# EAGLE design driver_board_v3_shift_regs (EAGLE 6.5.0)
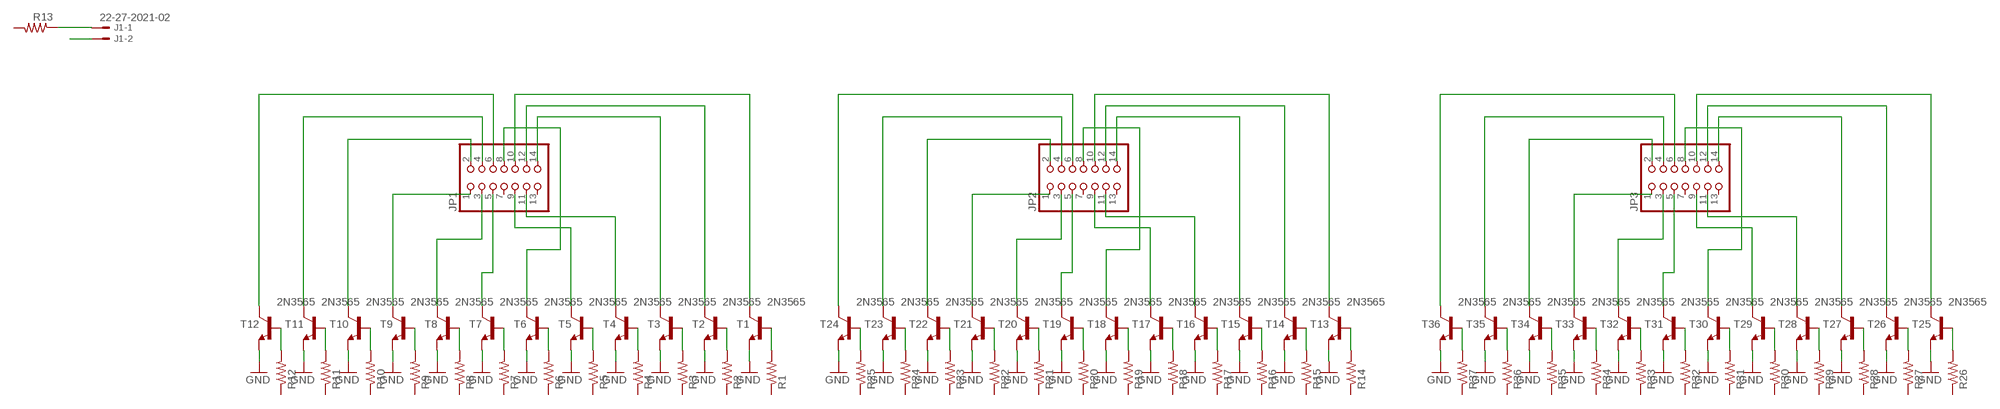
[diagram p0: schematic, sheet 1, part 1 of 2]
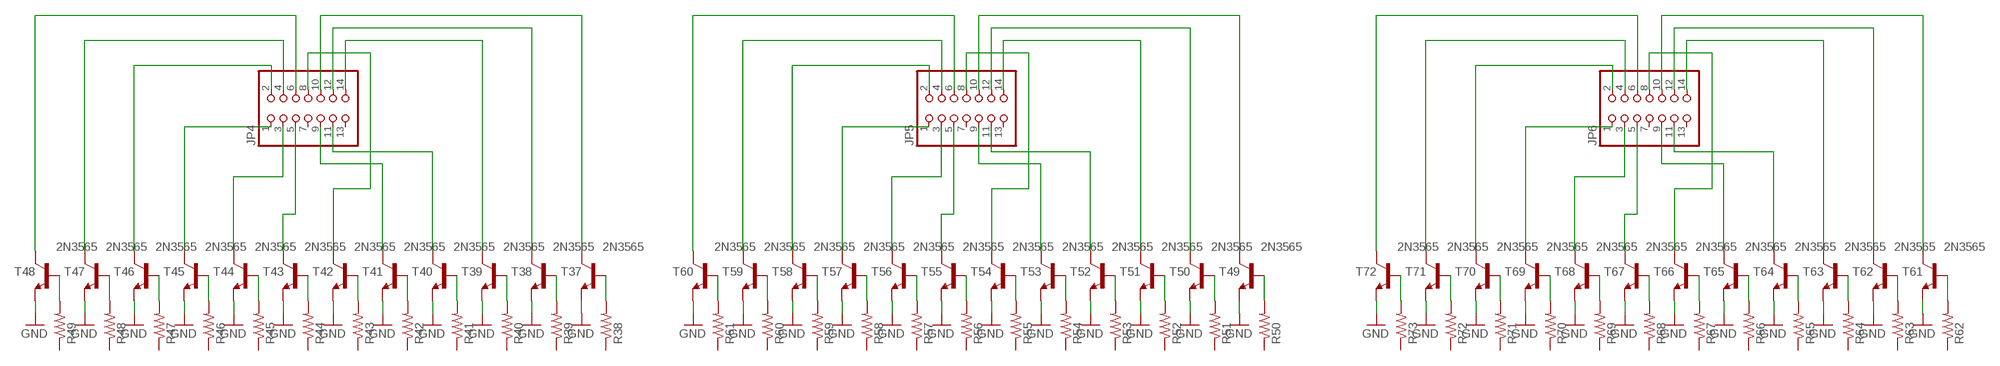
[diagram p1: schematic, sheet 1, part 2 of 2]

## Parts
J1  22-27-2021-02  [6410-02]
JP1  PINHD-2X7  [2X07]
JP2  PINHD-2X7  [2X07]
JP3  PINHD-2X7  [2X07]
JP4  PINHD-2X7  [2X07]
JP5  PINHD-2X7  [2X07]
JP6  PINHD-2X7  [2X07]
R1  R-US_0204/7  [0204/7]
R2  R-US_0204/7  [0204/7]
R3  R-US_0204/7  [0204/7]
R4  R-US_0204/7  [0204/7]
R5  R-US_0204/7  [0204/7]
R6  R-US_0204/7  [0204/7]
R7  R-US_0204/7  [0204/7]
R8  R-US_0204/7  [0204/7]
R9  R-US_0204/7  [0204/7]
R10  R-US_0204/7  [0204/7]
R11  R-US_0204/7  [0204/7]
R12  R-US_0204/7  [0204/7]
R13  R-US_0204/7  [0204/7]
R14  R-US_0204/7  [0204/7]
R15  R-US_0204/7  [0204/7]
R16  R-US_0204/7  [0204/7]
R17  R-US_0204/7  [0204/7]
R18  R-US_0204/7  [0204/7]
R19  R-US_0204/7  [0204/7]
R20  R-US_0204/7  [0204/7]
R21  R-US_0204/7  [0204/7]
R22  R-US_0204/7  [0204/7]
R23  R-US_0204/7  [0204/7]
R24  R-US_0204/7  [0204/7]
R25  R-US_0204/7  [0204/7]
R26  R-US_0204/7  [0204/7]
R27  R-US_0204/7  [0204/7]
R28  R-US_0204/7  [0204/7]
R29  R-US_0204/7  [0204/7]
R30  R-US_0204/7  [0204/7]
R31  R-US_0204/7  [0204/7]
R32  R-US_0204/7  [0204/7]
R33  R-US_0204/7  [0204/7]
R34  R-US_0204/7  [0204/7]
R35  R-US_0204/7  [0204/7]
R36  R-US_0204/7  [0204/7]
R37  R-US_0204/7  [0204/7]
R38  R-US_0204/7  [0204/7]
R39  R-US_0204/7  [0204/7]
R40  R-US_0204/7  [0204/7]
R41  R-US_0204/7  [0204/7]
R42  R-US_0204/7  [0204/7]
R43  R-US_0204/7  [0204/7]
R44  R-US_0204/7  [0204/7]
R45  R-US_0204/7  [0204/7]
R46  R-US_0204/7  [0204/7]
R47  R-US_0204/7  [0204/7]
R48  R-US_0204/7  [0204/7]
R49  R-US_0204/7  [0204/7]
R50  R-US_0204/7  [0204/7]
R51  R-US_0204/7  [0204/7]
R52  R-US_0204/7  [0204/7]
R53  R-US_0204/7  [0204/7]
R54  R-US_0204/7  [0204/7]
R55  R-US_0204/7  [0204/7]
R56  R-US_0204/7  [0204/7]
R57  R-US_0204/7  [0204/7]
R58  R-US_0204/7  [0204/7]
R59  R-US_0204/7  [0204/7]
R60  R-US_0204/7  [0204/7]
R61  R-US_0204/7  [0204/7]
R62  R-US_0204/7  [0204/7]
R63  R-US_0204/7  [0204/7]
R64  R-US_0204/7  [0204/7]
R65  R-US_0204/7  [0204/7]
R66  R-US_0204/7  [0204/7]
R67  R-US_0204/7  [0204/7]
R68  R-US_0204/7  [0204/7]
R69  R-US_0204/7  [0204/7]
R70  R-US_0204/7  [0204/7]
R71  R-US_0204/7  [0204/7]
R72  R-US_0204/7  [0204/7]
R73  R-US_0204/7  [0204/7]
T1  2N3565  [TO92]
T2  2N3565  [TO92]
T3  2N3565  [TO92]
T4  2N3565  [TO92]
T5  2N3565  [TO92]
T6  2N3565  [TO92]
T7  2N3565  [TO92]
T8  2N3565  [TO92]
T9  2N3565  [TO92]
T10  2N3565  [TO92]
T11  2N3565  [TO92]
T12  2N3565  [TO92]
T13  2N3565  [TO92]
T14  2N3565  [TO92]
T15  2N3565  [TO92]
T16  2N3565  [TO92]
T17  2N3565  [TO92]
T18  2N3565  [TO92]
T19  2N3565  [TO92]
T20  2N3565  [TO92]
T21  2N3565  [TO92]
T22  2N3565  [TO92]
T23  2N3565  [TO92]
T24  2N3565  [TO92]
T25  2N3565  [TO92]
T26  2N3565  [TO92]
T27  2N3565  [TO92]
T28  2N3565  [TO92]
T29  2N3565  [TO92]
T30  2N3565  [TO92]
T31  2N3565  [TO92]
T32  2N3565  [TO92]
T33  2N3565  [TO92]
T34  2N3565  [TO92]
T35  2N3565  [TO92]
T36  2N3565  [TO92]
T37  2N3565  [TO92]
T38  2N3565  [TO92]
T39  2N3565  [TO92]
T40  2N3565  [TO92]
T41  2N3565  [TO92]
T42  2N3565  [TO92]
T43  2N3565  [TO92]
T44  2N3565  [TO92]
T45  2N3565  [TO92]
T46  2N3565  [TO92]
T47  2N3565  [TO92]
T48  2N3565  [TO92]
T49  2N3565  [TO92]
T50  2N3565  [TO92]
T51  2N3565  [TO92]
T52  2N3565  [TO92]
T53  2N3565  [TO92]
T54  2N3565  [TO92]
T55  2N3565  [TO92]
T56  2N3565  [TO92]
T57  2N3565  [TO92]
T58  2N3565  [TO92]
T59  2N3565  [TO92]
T60  2N3565  [TO92]
T61  2N3565  [TO92]
T62  2N3565  [TO92]
T63  2N3565  [TO92]
T64  2N3565  [TO92]
T65  2N3565  [TO92]
T66  2N3565  [TO92]
T67  2N3565  [TO92]
T68  2N3565  [TO92]
T69  2N3565  [TO92]
T70  2N3565  [TO92]
T71  2N3565  [TO92]
T72  2N3565  [TO92]

## Nets
GND: T1.3(E) T2.3(E) T3.3(E) T4.3(E) T5.3(E) T6.3(E) T7.3(E) T8.3(E) T9.3(E) T10.3(E) T11.3(E) T12.3(E) T13.3(E) T14.3(E) T15.3(E) T16.3(E) T17.3(E) T18.3(E) T19.3(E) T20.3(E) T21.3(E) T22.3(E) T23.3(E) T24.3(E) T25.3(E) T26.3(E) T27.3(E) T28.3(E) T29.3(E) T30.3(E) T31.3(E) T32.3(E) T33.3(E) T34.3(E) T35.3(E) T36.3(E) T37.3(E) T38.3(E) T39.3(E) T40.3(E) T41.3(E) T42.3(E) T43.3(E) T44.3(E) T45.3(E) T46.3(E) T47.3(E) T48.3(E) T49.3(E) T50.3(E) T51.3(E) T52.3(E) T53.3(E) T54.3(E) T55.3(E) T56.3(E) T57.3(E) T58.3(E) T59.3(E) T60.3(E) T61.3(E) T62.3(E) T63.3(E) T64.3(E) T65.3(E) T66.3(E) T67.3(E) T68.3(E) T69.3(E) T70.3(E) T71.3(E) T72.3(E)
N$1: R12.2 T12.2(B)
N$2: R11.2 T11.2(B)
N$3: R10.2 T10.2(B)
N$4: R9.2 T9.2(B)
N$5: R8.2 T8.2(B)
N$6: R7.2 T7.2(B)
N$7: R6.2 T6.2(B)
N$8: R5.2 T5.2(B)
N$9: R4.2 T4.2(B)
N$10: R3.2 T3.2(B)
N$11: R2.2 T2.2(B)
N$12: R1.2 T1.2(B)
N$13: JP1.6 T12.1(C)
N$14: JP1.4 T11.1(C)
N$15: JP1.2 T10.1(C)
N$16: JP1.1 T9.1(C)
N$17: JP1.3 T8.1(C)
N$18: JP1.5 T7.1(C)
N$19: JP1.10 T1.1(C)
N$20: JP1.12 T2.1(C)
N$21: JP1.14 T3.1(C)
N$22: JP1.8 T6.1(C)
N$23: JP1.9 T5.1(C)
N$24: JP1.11 T4.1(C)
N$25: J1.1 R13.1
N$26: R25.2 T24.2(B)
N$27: R24.2 T23.2(B)
N$28: R23.2 T22.2(B)
N$29: R22.2 T21.2(B)
N$30: R21.2 T20.2(B)
N$31: R20.2 T19.2(B)
N$32: R19.2 T18.2(B)
N$33: R18.2 T17.2(B)
N$34: R17.2 T16.2(B)
N$35: R16.2 T15.2(B)
N$36: R15.2 T14.2(B)
N$37: R14.2 T13.2(B)
N$38: JP2.6 T24.1(C)
N$39: JP2.4 T23.1(C)
N$40: JP2.2 T22.1(C)
N$41: JP2.1 T21.1(C)
N$42: JP2.3 T20.1(C)
N$43: JP2.5 T19.1(C)
N$44: JP2.10 T13.1(C)
N$45: JP2.12 T14.1(C)
N$46: JP2.14 T15.1(C)
N$47: JP2.8 T18.1(C)
N$48: JP2.9 T17.1(C)
N$49: JP2.11 T16.1(C)
N$50: J1.2
N$51: R37.2 T36.2(B)
N$52: R36.2 T35.2(B)
N$53: R35.2 T34.2(B)
N$54: R34.2 T33.2(B)
N$55: R33.2 T32.2(B)
N$56: R32.2 T31.2(B)
N$57: R31.2 T30.2(B)
N$58: R30.2 T29.2(B)
N$59: R29.2 T28.2(B)
N$60: R28.2 T27.2(B)
N$61: R27.2 T26.2(B)
N$62: R26.2 T25.2(B)
N$63: JP3.6 T36.1(C)
N$64: JP3.4 T35.1(C)
N$65: JP3.2 T34.1(C)
N$66: JP3.1 T33.1(C)
N$67: JP3.3 T32.1(C)
N$68: JP3.5 T31.1(C)
N$69: JP3.10 T25.1(C)
N$70: JP3.12 T26.1(C)
N$71: JP3.14 T27.1(C)
N$72: JP3.8 T30.1(C)
N$73: JP3.9 T29.1(C)
N$74: JP3.11 T28.1(C)
N$75: R49.2 T48.2(B)
N$76: R48.2 T47.2(B)
N$77: R47.2 T46.2(B)
N$78: R46.2 T45.2(B)
N$79: R45.2 T44.2(B)
N$80: R44.2 T43.2(B)
N$81: R43.2 T42.2(B)
N$82: R42.2 T41.2(B)
N$83: R41.2 T40.2(B)
N$84: R40.2 T39.2(B)
N$85: R39.2 T38.2(B)
N$86: R38.2 T37.2(B)
N$87: JP4.6 T48.1(C)
N$88: JP4.4 T47.1(C)
N$89: JP4.2 T46.1(C)
N$90: JP4.1 T45.1(C)
N$91: JP4.3 T44.1(C)
N$92: JP4.5 T43.1(C)
N$93: JP4.10 T37.1(C)
N$94: JP4.12 T38.1(C)
N$95: JP4.14 T39.1(C)
N$96: JP4.8 T42.1(C)
N$97: JP4.9 T41.1(C)
N$98: JP4.11 T40.1(C)
N$99: R61.2 T60.2(B)
N$100: R60.2 T59.2(B)
N$101: R59.2 T58.2(B)
N$102: R58.2 T57.2(B)
N$103: R57.2 T56.2(B)
N$104: R56.2 T55.2(B)
N$105: R55.2 T54.2(B)
N$106: R54.2 T53.2(B)
N$107: R53.2 T52.2(B)
N$108: R52.2 T51.2(B)
N$109: R51.2 T50.2(B)
N$110: R50.2 T49.2(B)
N$111: JP5.6 T60.1(C)
N$112: JP5.4 T59.1(C)
N$113: JP5.2 T58.1(C)
N$114: JP5.1 T57.1(C)
N$115: JP5.3 T56.1(C)
N$116: JP5.5 T55.1(C)
N$117: JP5.10 T49.1(C)
N$118: JP5.12 T50.1(C)
N$119: JP5.14 T51.1(C)
N$120: JP5.8 T54.1(C)
N$121: JP5.9 T53.1(C)
N$122: JP5.11 T52.1(C)
N$123: R73.2 T72.2(B)
N$124: R72.2 T71.2(B)
N$125: R71.2 T70.2(B)
N$126: R70.2 T69.2(B)
N$127: R69.2 T68.2(B)
N$128: R68.2 T67.2(B)
N$129: R67.2 T66.2(B)
N$130: R66.2 T65.2(B)
N$131: R65.2 T64.2(B)
N$132: R64.2 T63.2(B)
N$133: R63.2 T62.2(B)
N$134: R62.2 T61.2(B)
N$135: JP6.6 T72.1(C)
N$136: JP6.4 T71.1(C)
N$137: JP6.2 T70.1(C)
N$138: JP6.1 T69.1(C)
N$139: JP6.3 T68.1(C)
N$140: JP6.5 T67.1(C)
N$141: JP6.10 T61.1(C)
N$142: JP6.12 T62.1(C)
N$143: JP6.14 T63.1(C)
N$144: JP6.8 T66.1(C)
N$145: JP6.9 T65.1(C)
N$146: JP6.11 T64.1(C)
Unconnected: JP1.7 JP1.13 JP2.7 JP2.13 JP3.7 JP3.13 JP4.7 JP4.13 JP5.7 JP5.13 JP6.7 JP6.13 R1.1 R2.1 R3.1 R4.1 R5.1 R6.1 R7.1 R8.1 R9.1 R10.1 R11.1 R12.1 R13.2 R14.1 R15.1 R16.1 R17.1 R18.1 R19.1 R20.1 R21.1 R22.1 R23.1 R24.1 R25.1 R26.1 R27.1 R28.1 R29.1 R30.1 R31.1 R32.1 R33.1 R34.1 R35.1 R36.1 R37.1 R38.1 R39.1 R40.1 R41.1 R42.1 R43.1 R44.1 R45.1 R46.1 R47.1 R48.1 R49.1 R50.1 R51.1 R52.1 R53.1 R54.1 R55.1 R56.1 R57.1 R58.1 R59.1 R60.1 R61.1 R62.1 R63.1 R64.1 R65.1 R66.1 R67.1 R68.1 R69.1 R70.1 R71.1 R72.1 R73.1

## Library data of the parts
J1 = con-molex:22-?-02: CONNECTOR wire to board 2.54 mm (.1 inch) pitch header; OC_FARNELL: unknown; OC_NEWARK: unknown
JP1-JP6 = pinhead:PINHD-2X7: PIN HEADER
R1-R73 = resistor:R-US_: RESISTOR, American symbol
T1-T72 = transistor:2N3565: NPN TRANSISTOR

## Board
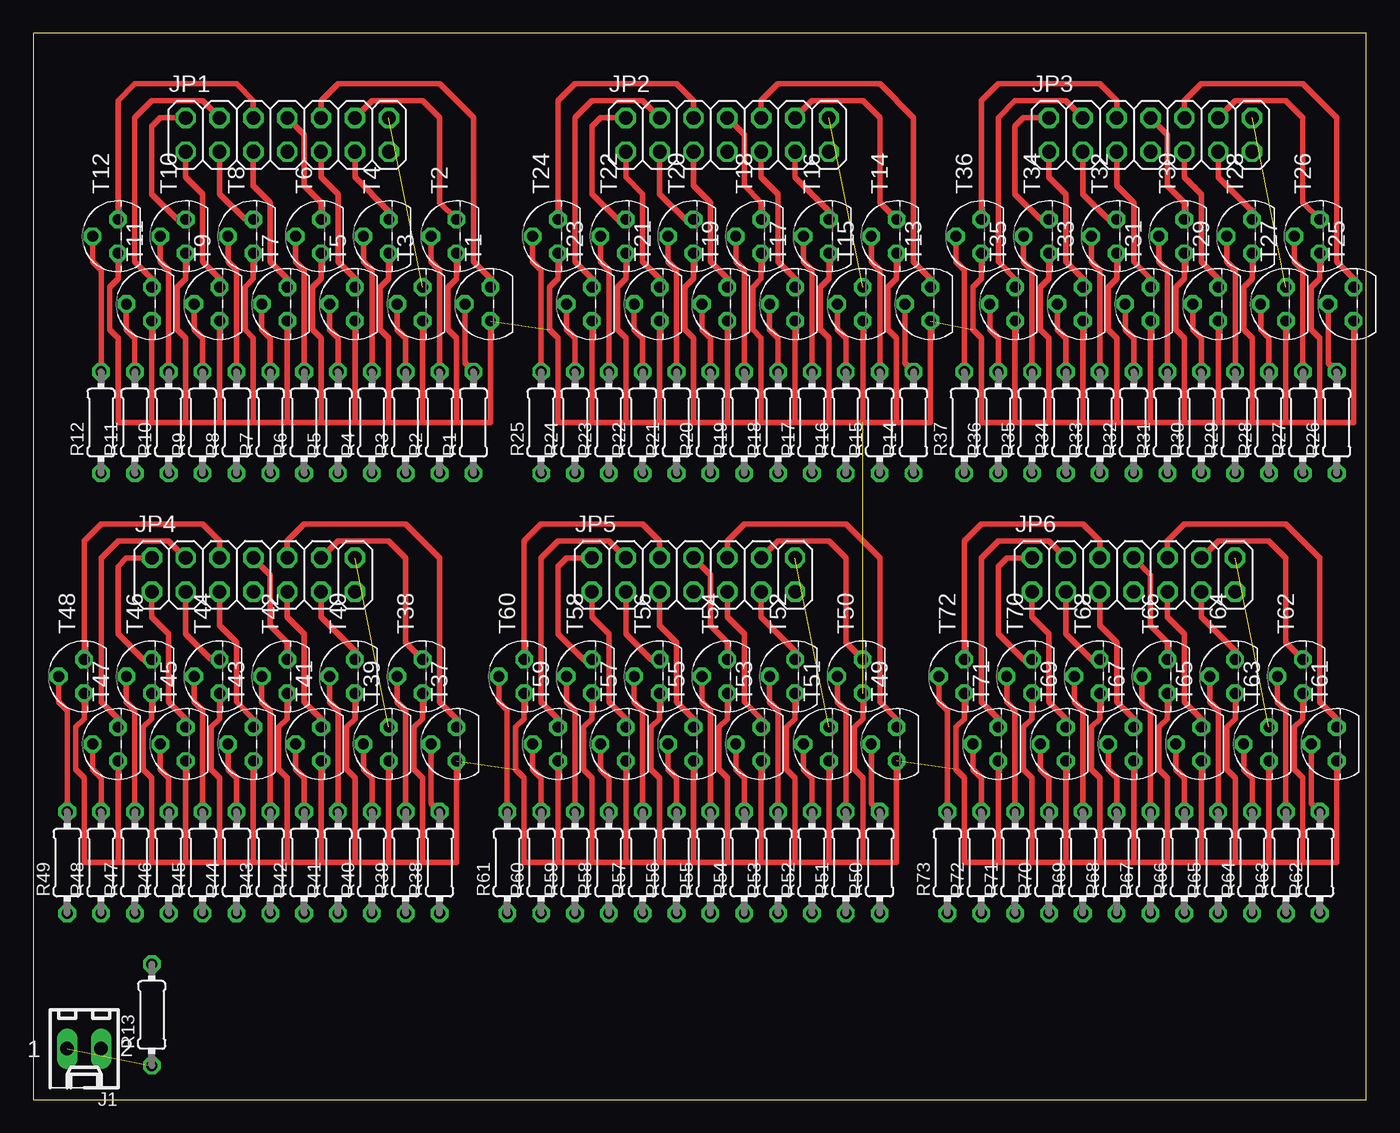
[diagram p2: board, top side]

Size 100 x 80 mm. Coordinates in mm from the lower left corner, seen from the top.
Outline: 0,0 100,0 100,80 0,80 0,0
Copper layers (1*16): Top 0.035mm / dielectric 1.5mm / Bottom 0.035mm
Design rules "default": minimum track width 10mil, minimum drill 24mil, track to track 8mil, track to pad 8mil, pad to pad 8mil, via to via 8mil, smd to smd 8mil, copper to edge 40mil, drill to drill 8mil, minimum pad ring 10mil, minimum via ring 8mil, stop-mask expansion 4mil, vias tented up to drill 0mil, thermal gap 10mil

### Footprints (pad centres in the part's own frame; a part is rotated, then mirrored left to right if it is on the bottom)
6410-02 = drill 1.016 long: 1 1.27,0; 2 -1.27,0
2X07 = drill 1.016 octagon: 1 -7.62,-1.27; 2 -7.62,1.27; 3 -5.08,-1.27; 4 -5.08,1.27; 5 -2.54,-1.27; 6 -2.54,1.27; 7 0,-1.27; 8 0,1.27; 9 2.54,-1.27; 10 2.54,1.27; 11 5.08,-1.27; 12 5.08,1.27; 13 7.62,-1.27; 14 7.62,1.27
0204/7 = drill 0.813 octagon: 1 -3.81,0; 2 3.81,0
TO92 = drill 0.813 octagon: 1 1.27,0; 2 0,1.905; 3 -1.27,0

### Placement (x,y rotation side)
J1  3.81,3.81 180 top
JP1  19.05,72.39 0 top
JP2  52.07,72.39 0 top
JP3  83.82,72.39 0 top
JP4  16.51,39.37 0 top
JP5  49.53,39.37 0 top
JP6  82.55,39.37 0 top
R1  33.02,50.8 90 top
R2  30.48,50.8 90 top
R3  27.94,50.8 90 top
R4  25.4,50.8 90 top
R5  22.86,50.8 90 top
R6  20.32,50.8 90 top
R7  17.78,50.8 90 top
R8  15.24,50.8 90 top
R9  12.7,50.8 90 top
R10  10.16,50.8 90 top
R11  7.62,50.8 90 top
R12  5.08,50.8 90 top
R13  8.89,6.35 90 top
R14  66.04,50.8 90 top
R15  63.5,50.8 90 top
R16  60.96,50.8 90 top
R17  58.42,50.8 90 top
R18  55.88,50.8 90 top
R19  53.34,50.8 90 top
R20  50.8,50.8 90 top
R21  48.26,50.8 90 top
R22  45.72,50.8 90 top
R23  43.18,50.8 90 top
R24  40.64,50.8 90 top
R25  38.1,50.8 90 top
R26  97.79,50.8 90 top
R27  95.25,50.8 90 top
R28  92.71,50.8 90 top
R29  90.17,50.8 90 top
R30  87.63,50.8 90 top
R31  85.09,50.8 90 top
R32  82.55,50.8 90 top
R33  80.01,50.8 90 top
R34  77.47,50.8 90 top
R35  74.93,50.8 90 top
R36  72.39,50.8 90 top
R37  69.85,50.8 90 top
R38  30.48,17.78 90 top
R39  27.94,17.78 90 top
R40  25.4,17.78 90 top
R41  22.86,17.78 90 top
R42  20.32,17.78 90 top
R43  17.78,17.78 90 top
R44  15.24,17.78 90 top
R45  12.7,17.78 90 top
R46  10.16,17.78 90 top
R47  7.62,17.78 90 top
R48  5.08,17.78 90 top
R49  2.54,17.78 90 top
R50  63.5,17.78 90 top
R51  60.96,17.78 90 top
R52  58.42,17.78 90 top
R53  55.88,17.78 90 top
R54  53.34,17.78 90 top
R55  50.8,17.78 90 top
R56  48.26,17.78 90 top
R57  45.72,17.78 90 top
R58  43.18,17.78 90 top
R59  40.64,17.78 90 top
R60  38.1,17.78 90 top
R61  35.56,17.78 90 top
R62  96.52,17.78 90 top
R63  93.98,17.78 90 top
R64  91.44,17.78 90 top
R65  88.9,17.78 90 top
R66  86.36,17.78 90 top
R67  83.82,17.78 90 top
R68  81.28,17.78 90 top
R69  78.74,17.78 90 top
R70  76.2,17.78 90 top
R71  73.66,17.78 90 top
R72  71.12,17.78 90 top
R73  68.58,17.78 90 top
T1  34.29,59.69 90 top
T2  31.75,64.77 90 top
T3  29.21,59.69 90 top
T4  26.67,64.77 90 top
T5  24.13,59.69 90 top
T6  21.59,64.77 90 top
T7  19.05,59.69 90 top
T8  16.51,64.77 90 top
T9  13.97,59.69 90 top
T10  11.43,64.77 90 top
T11  8.89,59.69 90 top
T12  6.35,64.77 90 top
T13  67.31,59.69 90 top
T14  64.77,64.77 90 top
T15  62.23,59.69 90 top
T16  59.69,64.77 90 top
T17  57.15,59.69 90 top
T18  54.61,64.77 90 top
T19  52.07,59.69 90 top
T20  49.53,64.77 90 top
T21  46.99,59.69 90 top
T22  44.45,64.77 90 top
T23  41.91,59.69 90 top
T24  39.37,64.77 90 top
T25  99.06,59.69 90 top
T26  96.52,64.77 90 top
T27  93.98,59.69 90 top
T28  91.44,64.77 90 top
T29  88.9,59.69 90 top
T30  86.36,64.77 90 top
T31  83.82,59.69 90 top
T32  81.28,64.77 90 top
T33  78.74,59.69 90 top
T34  76.2,64.77 90 top
T35  73.66,59.69 90 top
T36  71.12,64.77 90 top
T37  31.75,26.67 90 top
T38  29.21,31.75 90 top
T39  26.67,26.67 90 top
T40  24.13,31.75 90 top
T41  21.59,26.67 90 top
T42  19.05,31.75 90 top
T43  16.51,26.67 90 top
T44  13.97,31.75 90 top
T45  11.43,26.67 90 top
T46  8.89,31.75 90 top
T47  6.35,26.67 90 top
T48  3.81,31.75 90 top
T49  64.77,26.67 90 top
T50  62.23,31.75 90 top
T51  59.69,26.67 90 top
T52  57.15,31.75 90 top
T53  54.61,26.67 90 top
T54  52.07,31.75 90 top
T55  49.53,26.67 90 top
T56  46.99,31.75 90 top
T57  44.45,26.67 90 top
T58  41.91,31.75 90 top
T59  39.37,26.67 90 top
T60  36.83,31.75 90 top
T61  97.79,26.67 90 top
T62  95.25,31.75 90 top
T63  92.71,26.67 90 top
T64  90.17,31.75 90 top
T65  87.63,26.67 90 top
T66  85.09,31.75 90 top
T67  82.55,26.67 90 top
T68  80.01,31.75 90 top
T69  77.47,26.67 90 top
T70  74.93,31.75 90 top
T71  72.39,26.67 90 top
T72  69.85,31.75 90 top

### Tracks (layer width: path | path; a pad name or v marks a point on that pad's centre or on a via)
GND  (5 unrouted)
  Top 0.406: T11.3 8.89,50.8 | 8.89,50.8 11.43,50.8 | 11.43,50.8 13.97,50.8 | 13.97,50.8 T9.3 | T10.3 11.43,61.59 10.79,60.96 10.79,57.78 11.43,57.15 11.43,50.8 | T12.3 6.35,61.59 5.71,60.96 5.71,57.78 6.35,57.15 6.35,50.8 8.89,50.8 | T8.3 16.51,61.59 15.88,60.96 15.88,57.78 16.51,57.15 16.51,50.8 | 16.51,50.8 19.05,50.8 | 19.05,50.8 T7.3 | T5.3 24.13,50.8 | 24.13,50.8 21.59,50.8 | 21.59,50.8 19.05,50.8 | T3.3 29.21,50.8 | 29.21,50.8 26.67,50.8 | 26.67,50.8 24.13,50.8 | 16.51,50.8 13.97,50.8 | T1.3 34.29,50.8 31.75,50.8 | 31.75,50.8 29.21,50.8 | T2.3 31.75,61.59 31.11,60.96 31.11,57.78 31.75,57.15 31.75,50.8 | T4.3 26.67,61.59 26.04,60.96 26.04,57.78 26.67,57.15 26.67,50.8 | T6.3 21.59,61.59 20.95,60.96 20.95,57.78 21.59,57.15 21.59,50.8 | T59.3 39.37,17.78 | 39.37,17.78 41.91,17.78 | 41.91,17.78 44.45,17.78 | 44.45,17.78 T57.3 | T58.3 41.91,28.57 41.27,27.94 41.27,24.77 41.91,24.13 41.91,17.78 | T60.3 36.83,28.57 36.2,27.94 36.2,24.77 36.83,24.13 36.83,17.78 39.37,17.78 | T56.3 46.99,28.57 46.35,27.94 46.35,24.77 46.99,24.13 46.99,17.78 | 46.99,17.78 49.53,17.78 | 49.53,17.78 T55.3 | T53.3 54.61,17.78 | 54.61,17.78 52.07,17.78 | 52.07,17.78 49.53,17.78 | T51.3 59.69,17.78 | 59.69,17.78 57.15,17.78 | 57.15,17.78 54.61,17.78 | 46.99,17.78 44.45,17.78 | T49.3 64.77,17.78 62.23,17.78 | 62.23,17.78 59.69,17.78 | T50.3 62.23,28.57 61.59,27.94 61.59,24.77 62.23,24.13 62.23,17.78 | T52.3 57.15,28.57 56.52,27.94 56.52,24.77 57.15,24.13 57.15,17.78 | T54.3 52.07,28.57 51.44,27.94 51.44,24.77 52.07,24.13 52.07,17.78 | T71.3 72.39,17.78 | 72.39,17.78 74.93,17.78 | 74.93,17.78 77.47,17.78 | 77.47,17.78 T69.3 | T70.3 74.93,28.57 74.3,27.94 74.3,24.77 74.93,24.13 74.93,17.78
  Top 0.406: T72.3 69.85,28.57 69.22,27.94 69.22,24.77 69.85,24.13 69.85,17.78 72.39,17.78 | T68.3 80.01,28.57 79.38,27.94 79.38,24.77 80.01,24.13 80.01,17.78 | 80.01,17.78 82.55,17.78 | 82.55,17.78 T67.3 | T65.3 87.63,17.78 | 87.63,17.78 85.09,17.78 | 85.09,17.78 82.55,17.78 | T63.3 92.71,17.78 | 92.71,17.78 90.17,17.78 | 90.17,17.78 87.63,17.78 | 80.01,17.78 77.47,17.78 | T61.3 97.79,17.78 95.25,17.78 | 95.25,17.78 92.71,17.78 | T62.3 95.25,28.57 94.61,27.94 94.61,24.77 95.25,24.13 95.25,17.78 | T64.3 90.17,28.57 89.53,27.94 89.53,24.77 90.17,24.13 90.17,17.78 | T66.3 85.09,28.57 84.45,27.94 84.45,24.77 85.09,24.13 85.09,17.78 | T47.3 6.35,17.78 | 6.35,17.78 8.89,17.78 | 8.89,17.78 11.43,17.78 | 11.43,17.78 T45.3 | T46.3 8.89,28.57 8.26,27.94 8.26,24.77 8.89,24.13 8.89,17.78 | T48.3 3.81,28.57 3.17,27.94 3.17,24.77 3.81,24.13 3.81,17.78 6.35,17.78 | T44.3 13.97,28.57 13.34,27.94 13.34,24.77 13.97,24.13 13.97,17.78 | 13.97,17.78 16.51,17.78 | 16.51,17.78 T43.3 | T41.3 21.59,17.78 | 21.59,17.78 19.05,17.78 | 19.05,17.78 16.51,17.78 | T39.3 26.67,17.78 | 26.67,17.78 24.13,17.78 | 24.13,17.78 21.59,17.78 | 13.97,17.78 11.43,17.78 | T37.3 31.75,17.78 29.21,17.78 | 29.21,17.78 26.67,17.78 | T38.3 29.21,28.57 28.57,27.94 28.57,24.77 29.21,24.13 29.21,17.78 | T40.3 24.13,28.57 23.5,27.94 23.5,24.77 24.13,24.13 24.13,17.78 | T42.3 19.05,28.57 18.41,27.94 18.41,24.77 19.05,24.13 19.05,17.78 | T35.3 73.66,50.8 | 73.66,50.8 76.2,50.8 | 76.2,50.8 78.74,50.8 | 78.74,50.8 T33.3 | T34.3 76.2,61.59 75.56,60.96 75.56,57.78 76.2,57.15 76.2,50.8 | T36.3 71.12,61.59 70.48,60.96 70.48,57.78 71.12,57.15 71.12,50.8 73.66,50.8 | T32.3 81.28,61.59 80.64,60.96 80.64,57.78 81.28,57.15 81.28,50.8
  Top 0.406: 81.28,50.8 83.82,50.8 | 83.82,50.8 T31.3 | T29.3 88.9,50.8 | 88.9,50.8 86.36,50.8 | 86.36,50.8 83.82,50.8 | T27.3 93.98,50.8 | 93.98,50.8 91.44,50.8 | 91.44,50.8 88.9,50.8 | 81.28,50.8 78.74,50.8 | T25.3 99.06,50.8 96.52,50.8 | 96.52,50.8 93.98,50.8 | T26.3 96.52,61.59 95.89,60.96 95.89,57.78 96.52,57.15 96.52,50.8 | T28.3 91.44,61.59 90.81,60.96 90.81,57.78 91.44,57.15 91.44,50.8 | T30.3 86.36,61.59 85.72,60.96 85.72,57.78 86.36,57.15 86.36,50.8 | T23.3 41.91,50.8 | 41.91,50.8 44.45,50.8 | 44.45,50.8 46.99,50.8 | 46.99,50.8 T21.3 | T22.3 44.45,61.59 43.81,60.96 43.81,57.78 44.45,57.15 44.45,50.8 | T24.3 39.37,61.59 38.73,60.96 38.73,57.78 39.37,57.15 39.37,50.8 41.91,50.8 | T20.3 49.53,61.59 48.9,60.96 48.9,57.78 49.53,57.15 49.53,50.8 | 49.53,50.8 52.07,50.8 | 52.07,50.8 T19.3 | T17.3 57.15,50.8 | 57.15,50.8 54.61,50.8 | 54.61,50.8 52.07,50.8 | T15.3 62.23,50.8 | 62.23,50.8 59.69,50.8 | 59.69,50.8 57.15,50.8 | 49.53,50.8 46.99,50.8 | T13.3 67.31,50.8 64.77,50.8 | 64.77,50.8 62.23,50.8 | T14.3 64.77,61.59 64.14,60.96 64.14,57.78 64.77,57.15 64.77,50.8 | T16.3 59.69,61.59 59.05,60.96 59.05,57.78 59.69,57.15 59.69,50.8 | T18.3 54.61,61.59 53.98,60.96 53.98,57.78 54.61,57.15 54.61,50.8
N$1
  Top 0.406: T12.2 4.45,62.87 5.08,62.23 R12.2
N$2
  Top 0.406: T11.2 6.99,57.78 7.62,57.15 R11.2
N$3
  Top 0.406: T10.2 9.53,62.87 10.16,62.23 R10.2
N$4
  Top 0.406: T9.2 12.06,57.78 12.7,57.15 R9.2
N$5
  Top 0.406: R8.2 15.24,62.23 14.61,62.87 T8.2
N$6
  Top 0.406: R7.2 17.78,57.15 17.14,57.78 T7.2
N$7
  Top 0.406: R6.2 20.32,62.23 19.68,62.87 T6.2
N$8
  Top 0.406: R5.2 22.86,57.15 22.23,57.78 T5.2
N$9
  Top 0.406: R4.2 25.4,62.23 24.77,62.87 T4.2
N$10
  Top 0.406: R3.2 27.94,57.15 27.3,57.78 T3.2
N$11
  Top 0.406: R2.2 30.48,62.23 29.84,62.87 T2.2
N$12
  Top 0.406: R1.2 32.38,55.24 T1.2
N$13
  Top 0.406: T12.1 6.35,74.93 7.62,76.2 15.24,76.2 16.51,74.93 JP1.6
N$14
  Top 0.406: JP1.4 12.7,74.93 8.89,74.93 7.62,73.66 7.62,62.87 8.89,61.59 T11.1
N$15
  Top 0.406: JP1.2 9.53,73.66 8.89,73.03 8.89,67.94 10.79,66.04 T10.1
N$16
  Top 0.406: JP1.1 11.43,69.22 12.7,67.94 12.7,62.87 13.97,61.59 T9.1
N$17
  Top 0.406: JP1.3 13.97,67.94 15.88,66.04 T8.1
N$18
  Top 0.406: JP1.5 16.51,68.58 17.78,67.31 17.78,62.87 19.05,61.59 T7.1
N$19
  Top 0.406: JP1.10 21.59,74.93 22.86,76.2 30.48,76.2 33.02,73.66 33.02,62.87 34.29,61.59 T1.1
N$20
  Top 0.406: JP1.12 25.4,74.93 29.21,74.93 30.48,73.66 30.48,67.31 T2.1
N$21  (1 unrouted)
N$22
  Top 0.406: T6.1 21.59,67.31 20.32,68.58 20.32,72.39 JP1.8
N$23
  Top 0.406: JP1.9 21.59,69.22 22.86,67.94 22.86,62.87 24.13,61.59 T5.1
N$24
  Top 0.406: JP1.11 24.13,69.22 26.67,66.67 T4.1
N$25  (1 unrouted)
N$26
  Top 0.406: T24.2 37.47,62.87 38.1,62.23 R25.2
N$27
  Top 0.406: T23.2 40.01,57.78 40.64,57.15 R24.2
N$28
  Top 0.406: T22.2 42.55,62.87 43.18,62.23 R23.2
N$29
  Top 0.406: T21.2 45.09,57.78 45.72,57.15 R22.2
N$30
  Top 0.406: R21.2 48.26,62.23 47.62,62.87 T20.2
N$31
  Top 0.406: R20.2 50.8,57.15 50.16,57.78 T19.2
N$32
  Top 0.406: R19.2 53.34,62.23 52.7,62.87 T18.2
N$33
  Top 0.406: R18.2 55.88,57.15 55.24,57.78 T17.2
N$34
  Top 0.406: R17.2 58.42,62.23 57.78,62.87 T16.2
N$35
  Top 0.406: R16.2 60.96,57.15 60.33,57.78 T15.2
N$36
  Top 0.406: R15.2 63.5,62.23 62.87,62.87 T14.2
N$37
  Top 0.406: R14.2 65.41,55.24 T13.2
N$38
  Top 0.406: T24.1 39.37,74.93 40.64,76.2 48.26,76.2 49.53,74.93 JP2.6
N$39
  Top 0.406: JP2.4 45.72,74.93 41.91,74.93 40.64,73.66 40.64,62.87 41.91,61.59 T23.1
N$40
  Top 0.406: JP2.2 42.55,73.66 41.91,73.03 41.91,67.94 43.81,66.04 T22.1
N$41
  Top 0.406: JP2.1 44.45,69.22 45.72,67.94 45.72,62.87 46.99,61.59 T21.1
N$42
  Top 0.406: JP2.3 46.99,67.94 48.9,66.04 T20.1
N$43
  Top 0.406: JP2.5 49.53,68.58 50.8,67.31 50.8,62.87 52.07,61.59 T19.1
N$44
  Top 0.406: JP2.10 54.61,74.93 55.88,76.2 63.5,76.2 66.04,73.66 66.04,62.87 67.31,61.59 T13.1
N$45
  Top 0.406: JP2.12 58.42,74.93 62.23,74.93 63.5,73.66 63.5,67.31 T14.1
N$46  (1 unrouted)
N$47
  Top 0.406: T18.1 54.61,67.31 53.34,68.58 53.34,72.39 JP2.8
N$48
  Top 0.406: JP2.9 54.61,69.22 55.88,67.94 55.88,62.87 57.15,61.59 T17.1
N$49
  Top 0.406: JP2.11 57.15,69.22 59.69,66.67 T16.1
N$51
  Top 0.406: T36.2 69.22,62.87 69.85,62.23 R37.2
N$52
  Top 0.406: T35.2 71.75,57.78 72.39,57.15 R36.2
N$53
  Top 0.406: T34.2 74.3,62.87 74.93,62.23 R35.2
N$54
  Top 0.406: T33.2 76.83,57.78 77.47,57.15 R34.2
N$55
  Top 0.406: R33.2 80.01,62.23 79.38,62.87 T32.2
N$56
  Top 0.406: R32.2 82.55,57.15 81.92,57.78 T31.2
N$57
  Top 0.406: R31.2 85.09,62.23 84.45,62.87 T30.2
N$58
  Top 0.406: R30.2 87.63,57.15 87,57.78 T29.2
N$59
  Top 0.406: R29.2 90.17,62.23 89.53,62.87 T28.2
N$60
  Top 0.406: R28.2 92.71,57.15 92.08,57.78 T27.2
N$61
  Top 0.406: R27.2 95.25,62.23 94.61,62.87 T26.2
N$62
  Top 0.406: R26.2 97.16,55.24 T25.2
N$63
  Top 0.406: T36.1 71.12,74.93 72.39,76.2 80.01,76.2 81.28,74.93 JP3.6
N$64
  Top 0.406: JP3.4 77.47,74.93 73.66,74.93 72.39,73.66 72.39,62.87 73.66,61.59 T35.1
N$65
  Top 0.406: JP3.2 74.3,73.66 73.66,73.03 73.66,67.94 75.56,66.04 T34.1
N$66
  Top 0.406: JP3.1 76.2,69.22 77.47,67.94 77.47,62.87 78.74,61.59 T33.1
N$67
  Top 0.406: JP3.3 78.74,67.94 80.64,66.04 T32.1
N$68
  Top 0.406: JP3.5 81.28,68.58 82.55,67.31 82.55,62.87 83.82,61.59 T31.1
N$69
  Top 0.406: JP3.10 86.36,74.93 87.63,76.2 95.25,76.2 97.79,73.66 97.79,62.87 99.06,61.59 T25.1
N$70
  Top 0.406: JP3.12 90.17,74.93 93.98,74.93 95.25,73.66 95.25,67.31 T26.1
N$71  (1 unrouted)
N$72
  Top 0.406: T30.1 86.36,67.31 85.09,68.58 85.09,72.39 JP3.8
N$73
  Top 0.406: JP3.9 86.36,69.22 87.63,67.94 87.63,62.87 88.9,61.59 T29.1
N$74
  Top 0.406: JP3.11 88.9,69.22 91.44,66.67 T28.1
N$75
  Top 0.406: T48.2 1.91,29.84 2.54,29.21 R49.2
N$76
  Top 0.406: T47.2 4.45,24.77 5.08,24.13 R48.2
N$77
  Top 0.406: T46.2 6.99,29.84 7.62,29.21 R47.2
N$78
  Top 0.406: T45.2 9.53,24.77 10.16,24.13 R46.2
N$79
  Top 0.406: R45.2 12.7,29.21 12.06,29.84 T44.2
N$80
  Top 0.406: R44.2 15.24,24.13 14.61,24.77 T43.2
N$81
  Top 0.406: R43.2 17.78,29.21 17.14,29.84 T42.2
N$82
  Top 0.406: R42.2 20.32,24.13 19.68,24.77 T41.2
N$83
  Top 0.406: R41.2 22.86,29.21 22.23,29.84 T40.2
N$84
  Top 0.406: R40.2 25.4,24.13 24.77,24.77 T39.2
N$85
  Top 0.406: R39.2 27.94,29.21 27.3,29.84 T38.2
N$86
  Top 0.406: R38.2 29.84,22.23 T37.2
N$87
  Top 0.406: T48.1 3.81,41.91 5.08,43.18 12.7,43.18 13.97,41.91 JP4.6
N$88
  Top 0.406: JP4.4 10.16,41.91 6.35,41.91 5.08,40.64 5.08,29.84 6.35,28.57 T47.1
N$89
  Top 0.406: JP4.2 6.99,40.64 6.35,40.01 6.35,34.92 8.26,33.02 T46.1
N$90
  Top 0.406: JP4.1 8.89,36.2 10.16,34.92 10.16,29.84 11.43,28.57 T45.1
N$91
  Top 0.406: JP4.3 11.43,34.92 13.34,33.02 T44.1
N$92
  Top 0.406: JP4.5 13.97,35.56 15.24,34.29 15.24,29.84 16.51,28.57 T43.1
N$93
  Top 0.406: JP4.10 19.05,41.91 20.32,43.18 27.94,43.18 30.48,40.64 30.48,29.84 31.75,28.57 T37.1
N$94
  Top 0.406: JP4.12 22.86,41.91 26.67,41.91 27.94,40.64 27.94,34.29 T38.1
N$95  (1 unrouted)
N$96
  Top 0.406: T42.1 19.05,34.29 17.78,35.56 17.78,39.37 JP4.8
N$97
  Top 0.406: JP4.9 19.05,36.2 20.32,34.92 20.32,29.84 21.59,28.57 T41.1
N$98
  Top 0.406: JP4.11 21.59,36.2 24.13,33.66 T40.1
N$99
  Top 0.406: T60.2 34.92,29.84 35.56,29.21 R61.2
N$100
  Top 0.406: T59.2 37.47,24.77 38.1,24.13 R60.2
N$101
  Top 0.406: T58.2 40.01,29.84 40.64,29.21 R59.2
N$102
  Top 0.406: T57.2 42.55,24.77 43.18,24.13 R58.2
N$103
  Top 0.406: R57.2 45.72,29.21 45.09,29.84 T56.2
N$104
  Top 0.406: R56.2 48.26,24.13 47.62,24.77 T55.2
N$105
  Top 0.406: R55.2 50.8,29.21 50.16,29.84 T54.2
N$106
  Top 0.406: R54.2 53.34,24.13 52.7,24.77 T53.2
N$107
  Top 0.406: R53.2 55.88,29.21 55.24,29.84 T52.2
N$108
  Top 0.406: R52.2 58.42,24.13 57.78,24.77 T51.2
N$109
  Top 0.406: R51.2 60.96,29.21 60.33,29.84 T50.2
N$110
  Top 0.406: R50.2 62.87,22.23 T49.2
N$111
  Top 0.406: T60.1 36.83,41.91 38.1,43.18 45.72,43.18 46.99,41.91 JP5.6
N$112
  Top 0.406: JP5.4 43.18,41.91 39.37,41.91 38.1,40.64 38.1,29.84 39.37,28.57 T59.1
N$113
  Top 0.406: JP5.2 40.01,40.64 39.37,40.01 39.37,34.92 41.27,33.02 T58.1
N$114
  Top 0.406: JP5.1 41.91,36.2 43.18,34.92 43.18,29.84 44.45,28.57 T57.1
N$115
  Top 0.406: JP5.3 44.45,34.92 46.35,33.02 T56.1
N$116
  Top 0.406: JP5.5 46.99,35.56 48.26,34.29 48.26,29.84 49.53,28.57 T55.1
N$117
  Top 0.406: JP5.10 52.07,41.91 53.34,43.18 60.96,43.18 63.5,40.64 63.5,29.84 64.77,28.57 T49.1
N$118
  Top 0.406: JP5.12 55.88,41.91 59.69,41.91 60.96,40.64 60.96,34.29 T50.1
N$119  (1 unrouted)
N$120
  Top 0.406: T54.1 52.07,34.29 50.8,35.56 50.8,39.37 JP5.8
N$121
  Top 0.406: JP5.9 52.07,36.2 53.34,34.92 53.34,29.84 54.61,28.57 T53.1
N$122
  Top 0.406: JP5.11 54.61,36.2 57.15,33.66 T52.1
N$123
  Top 0.406: T72.2 67.94,29.84 68.58,29.21 R73.2
N$124
  Top 0.406: T71.2 70.48,24.77 71.12,24.13 R72.2
N$125
  Top 0.406: T70.2 73.03,29.84 73.66,29.21 R71.2
N$126
  Top 0.406: T69.2 75.56,24.77 76.2,24.13 R70.2
N$127
  Top 0.406: R69.2 78.74,29.21 78.11,29.84 T68.2
N$128
  Top 0.406: R68.2 81.28,24.13 80.64,24.77 T67.2
N$129
  Top 0.406: R67.2 83.82,29.21 83.19,29.84 T66.2
N$130
  Top 0.406: R66.2 86.36,24.13 85.72,24.77 T65.2
N$131
  Top 0.406: R65.2 88.9,29.21 88.27,29.84 T64.2
N$132
  Top 0.406: R64.2 91.44,24.13 90.81,24.77 T63.2
N$133
  Top 0.406: R63.2 93.98,29.21 93.34,29.84 T62.2
N$134
  Top 0.406: R62.2 95.89,22.23 T61.2
N$135
  Top 0.406: T72.1 69.85,41.91 71.12,43.18 78.74,43.18 80.01,41.91 JP6.6
N$136
  Top 0.406: JP6.4 76.2,41.91 72.39,41.91 71.12,40.64 71.12,29.84 72.39,28.57 T71.1
N$137
  Top 0.406: JP6.2 73.03,40.64 72.39,40.01 72.39,34.92 74.3,33.02 T70.1
N$138
  Top 0.406: JP6.1 74.93,36.2 76.2,34.92 76.2,29.84 77.47,28.57 T69.1
N$139
  Top 0.406: JP6.3 77.47,34.92 79.38,33.02 T68.1
N$140
  Top 0.406: JP6.5 80.01,35.56 81.28,34.29 81.28,29.84 82.55,28.57 T67.1
N$141
  Top 0.406: JP6.10 85.09,41.91 86.36,43.18 93.98,43.18 96.52,40.64 96.52,29.84 97.79,28.57 T61.1
N$142
  Top 0.406: JP6.12 88.9,41.91 92.71,41.91 93.98,40.64 93.98,34.29 T62.1
N$143  (1 unrouted)
N$144
  Top 0.406: T66.1 85.09,34.29 83.82,35.56 83.82,39.37 JP6.8
N$145
  Top 0.406: JP6.9 85.09,36.2 86.36,34.92 86.36,29.84 87.63,28.57 T65.1
N$146
  Top 0.406: JP6.11 87.63,36.2 90.17,33.66 T64.1